# EAGLE schematic USB-UART-Wiring-Example (EAGLE 9.3.1)
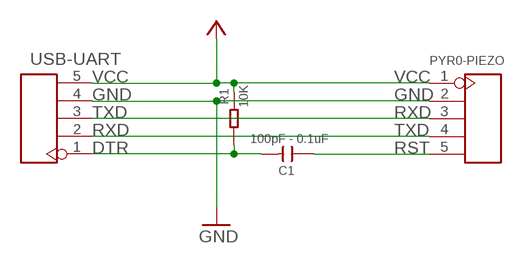
[diagram p0: schematic, sheet 1]

## Parts
C1  100pF - 0.1uF  SEEED-CAPACITOR_CERAMIC-10UF-25V-10%-X5R(0805)CAP_0603_GEN  [CAPC1609X80]
PYR0-PIEZO  JST-2.54MM_5P-2.54JST_2.54MM_5P_F  [HDRVR5W64P254_1X5_1270X254X575B]
R1  10K  SEEED-RESISTOR_SMD-RES-1.5K-1%-1/10W(0603)DETAILED_MODEL  [SEEED-RESISTOR_R0603]
USB-UART  JST-2.54MM_5P-2.54JST_2.54MM_5P_F  [HDRVR5W64P254_1X5_1270X254X575B]

## Nets
DTR: C1.2 R1.1 USB-UART.1
GND: PYR0-PIEZO.2 USB-UART.4
RST: C1.1 PYR0-PIEZO.5
RXD: PYR0-PIEZO.4 USB-UART.2
TXD: PYR0-PIEZO.3 USB-UART.3
VCC: PYR0-PIEZO.1 R1.2 USB-UART.5 ; supply symbol labelled SUPPLY1_VCC

## Library data of the parts
C1 = ESP32-Platform:SEEED-CAPACITOR_CERAMIC-10UF-25V-10%-X5R(0805): 302010178
PYR0-PIEZO USB-UART = PiezoFFC:JST-2.54MM_5P-2.54
R1 = ESP32-Platform:SEEED-RESISTOR_SMD-RES-1.5K-1%-1/10W(0603): 301010189